# Altium schematic sheet Signal_TX.SchDoc: Signal_TX
size A4; DocumentNumber: 3; SheetNumber: 3; SheetTotal: 8
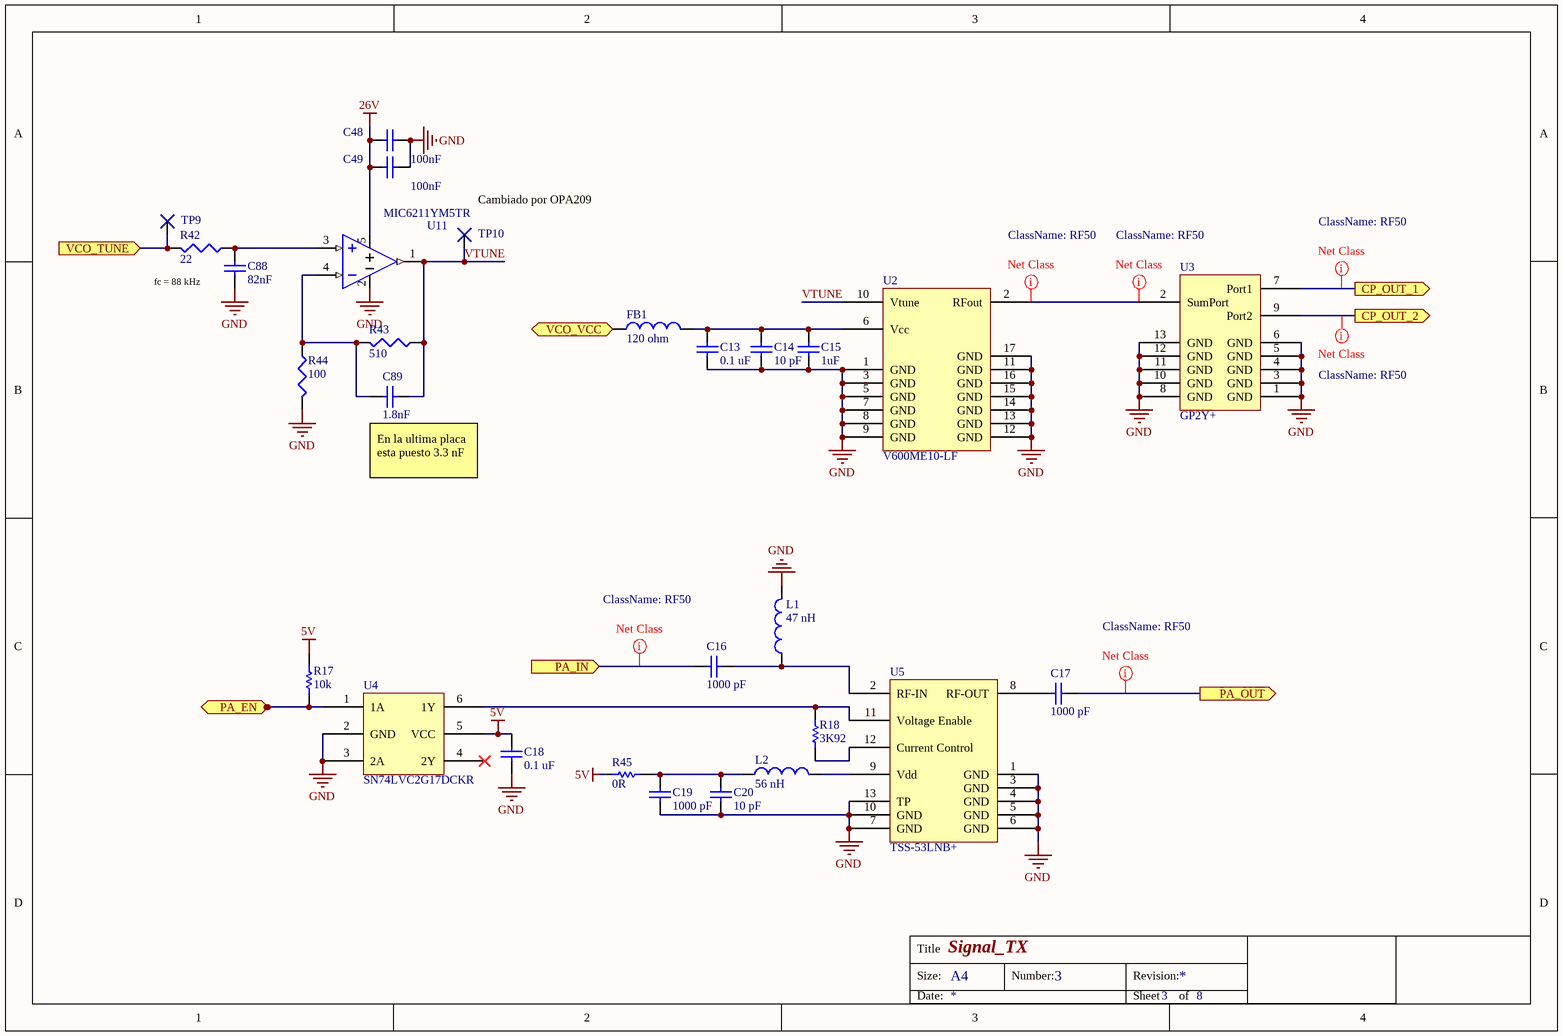
[diagram p0: Signal_TX.SchDoc]

## Parts
C13  0.1 uF  [0603 Cap]
C14  10 pF  [CAPC1005X05L]
C15  1uF  [0603 Cap]
C16  1000 pF  [CAPC1005X05L]
C17  1000 pF  [CAPC1005X05L]
C18  0.1 uF  [0603 Cap]
C19  1000 pF  [CAPC1005X05L]
C20  10 pF  [CAPC1005X05L]
C48  100nF  [0603 Cap]
C49  100nF  [0603 Cap]
C88  82nF  [0603 Cap]
C89  1.8nF  [0603 Cap]
FB1  120 ohm  [INDC1608X08L]
L1  47 nH  [INDC1005X07L]
L2  56 nH  [INDC1005X07L]
R17  10k  [0603 Res]
R18  3K92  [0603 Res]
R42  22  [J1-0603]
R43  510  [J1-0603]
R44  100  [J1-0603]
R45  0R  [0603 Res]
TP9  TEST_POINT_PIN  [TESTPOINT]  (value not drawn)  (no BOM)
TP10  TEST_POINT_PIN  [TESTPOINT]  (value not drawn)  (no BOM)
U2  V600ME10-LF  [CK605]
U3  GP2Y+  [DQ1225]
U4  SN74LVC2G17DCKR  [DCK (R-PDSO-G6)]
U5  TSS-53LNB+  [DQ1225]
U11  MIC6211YM5TR  [SOT95P280X90-5N2]

## Ports
CP_OUT_1 (out), CP_OUT_2 (out), PA_EN (in), PA_IN (in), PA_OUT (out), VCO_TUNE (in), VCO_VCC (in)

## Nets
5V: C18.2 R17.2 R45.2 U4.5(VCC)
26V: C48.2 C49.2 U11.5(V+)
GND: C13.1 C14.1 C15.1 C18.1 C19.1 C20.1 C48.1 C49.1 C88.1 L1.2 R44.2 U2.1(GND) U2.3(GND) U2.5(GND) U2.7(GND) U2.8(GND) U2.9(GND) U2.11(GND) U2.12(GND) U2.13(GND) U2.14(GND) U2.15(GND) U2.16(GND) U2.17(GND) U3.1(GND) U3.3(GND) U3.4(GND) U3.5(GND) U3.6(GND) U3.8(GND) U3.10(GND) U3.11(GND) U3.12(GND) U3.13(GND) U4.2(GND) U4.3(2A) U5.1(GND) U5.3(GND) U5.4(GND) U5.5(GND) U5.6(GND) U5.7(GND) U5.10(GND) U5.13(TP) U11.2(V-)
CP_OUT_1: U3.7(Port1) ; port CP_OUT_1
CP_OUT_2: U3.9(Port2) ; port CP_OUT_2
PA_EN: R17.1 U4.1(1A) ; port PA_EN
PA_IN: C16.1 ; port PA_IN
PA_OUT: C17.1 ; port PA_OUT
VCO_TUNE: R42.2 TP9.1 ; port VCO_TUNE
VCO_VCC: FB1.2 ; port VCO_VCC
VTUNE: C89.1 R43.1 TP10.1 U2.10(Vtune) U11.1(OUTA)
NetC13_2: C13.2 C14.2 C15.2 FB1.1 U2.6(Vcc)
NetC16_2: C16.2 L1.1 U5.2(RF-IN)
NetC17_2: C17.2 U5.8(RF-OUT)
NetC19_2: C19.2 C20.2 L2.1 R45.1
NetC88_2: C88.2 R42.1 U11.3(IN+)
NetC89_2: C89.2 R43.2 R44.1 U11.4(IN-)
NetL2_2: L2.2 U5.9(Vdd)
NetR18_1: R18.1 U5.12(Current_Control)
NetR18_2: R18.2 U4.6(1Y) U5.11(Voltage_Enable)
NetU2_2: U2.2(RFout) U3.2(SumPort)

Not connected (* = marked no-connect by the designer): U4 4(2Y)*

## Layout directives
net class RF50: CP_OUT_1, CP_OUT_2, NetU2_2, PA_IN, PA_OUT

## Notes on the sheet
- (near TP10) Cambiado por OPA209
- fc = 88 kHz
- (near C89) En la ultima placa esta puesto 3.3 nF
- Title
- Size:
- A4
- Number:
- Revision:
- Date:
- Sheet
- of

## Library data of the parts
C13 C18 = CC0603KRX7R7BB104: CAP CER 0.1UF 16V X7R 0603; Manufacturer: Yageo; Tolerance: 10; Capacitance: 100; Voltage Rating: 16; Min Temperature: -55; Material: Ceramic; Supplier 1: Digikey; Manufacturer Part Number: CC0603KRX7R7BB104; Stock 1: 2351469; Pricing 1: 1=0.1, 10=0.019, 25=0.014, 50=0.0104, 100=0.0085, 250=0.0071, 500=0.0061, 1000=0.0048 (USD); Mount: Surface Mount; Case/Package: 0603; Pins: 2; Case Code (Metric): 1608; Case Code (Imperial): 0603; Min Operating Temperature: -55; Max Operating Temperature: 125; Dielectric: X7R; Voltage Rating (DC): 16; Package Quantity: 4000; Packaging: Tape and Reel; Termination: SMD; Composition: Ceramic; Voltage: 16; Length: 1.6; Height: 0.8; Width: 0.8; Thickness: 0.035; Depth: 0.8; Radiation Hardening: No; REACH SVHC: No SVHC; ComponentLink1URL: https://datasheet.ciiva.com/11786/0900766b80d84f1d-11786077.pdf; ComponentLink1Description: https://datasheet.ciiva.com/11786/0900766b80d84f1d-11786077.pdf; ComponentLink2URL: https://datasheet.ciiva.com/15165/getdatasheetpartid-63554-15165387.pdf; ComponentLink2Description: https://datasheet.ciiva.com/15165/getdatasheetpartid-63554-15165387.pdf; ComponentLink3URL: https://datasheet.ciiva.com/13395/upy-gphc-x7r-6-3v-to-50v-8-13395674.pdf; ComponentLink3Description: https://datasheet.ciiva.com/13395/upy-gphc-x7r-6-3v-to-50v-8-13395674.pdf; ComponentLink4URL: https://datasheet.ciiva.com/46430/1734573-46430156.pdf; ComponentLink4Description: https://datasheet.ciiva.com/46430/1734573-46430156.pdf; ComponentLink5URL: https://datasheet.ciiva.com/11464/upy-gphc-x7r-6-3v-to-50v-8-11464735.pdf; ComponentLink5Description: https://datasheet.ciiva.com/11464/upy-gphc-x7r-6-3v-to-50v-8-11464735.pdf; ComponentLink6URL: https://datasheet.ciiva.com/7978/1489800-7978141.pdf; ComponentLink6Description: https://datasheet.ciiva.com/7978/1489800-7978141.pdf; ComponentLink7URL: https://datasheet.ciiva.com/28450/1489800-28450552.pdf; ComponentLink7Description: https://datasheet.ciiva.com/28450/1489800-28450552.pdf; ComponentLink8URL: https://datasheet.ciiva.com/16625/upy-gphc-x7r-6-3v-to-50v-8-16625526.pdf; ComponentLink8Description: https://datasheet.ciiva.com/16625/upy-gphc-x7r-6-3v-to-50v-8-16625526.pdf; ComponentLink9URL: https://datasheet.ciiva.com/144/mlccorderingcode-144182.pdf; ComponentLink9Description: https://datasheet.ciiva.com/144/mlccorderingcode-144182.pdf; ComponentLink10URL: https://datasheet.ciiva.com/8033/1734573-8033797.pdf; ComponentLink10Description: https://datasheet.ciiva.com/8033/1734573-8033797.pdf; ComponentLink11URL: https://datasheet.ciiva.com/144/mlccorderingcode-144184.pdf; ComponentLink11Description: https://datasheet.ciiva.com/144/mlccorderingcode-144184.pdf; ComponentLink12URL: https://datasheet.ciiva.com/8033/70765-8033799.pdf; ComponentLink12Description: https://datasheet.ciiva.com/8033/70765-8033799.pdf; ComponentLink13URL: https://datasheet.ciiva.com/144/mlccorderingcode-144183.pdf; ComponentLink13Description: https://datasheet.ciiva.com/144/mlccorderingcode-144183.pdf; Supplier Part Number 1: 311-1088-1-ND
C14 C20 = CL05C100JB5NNNC: CAP CER 10PF 50V 5% NP0 0402; Manufacturer: Samsung Electro-Mechanics America, Inc; Temperature Coefficient: C0G, NP0; Supplier 1: Digi-Key; Supplier Part Number 1: 1276-1139-1-ND; Manufacturer Part Number: CL05C100JB5NNNC; RoHS: RoHS Compliant; Category: Capacitors; Stock 1: 376482; Pricing 1: 1=0.09, 10=0.011, 25=0.008, 100=0.0052, 500=0.00366, 1000=0.00285, 2500=0.00256, 5000=0.00238 (EUR); Packaging: Cut Tape (CT); Capacitance: 10pF; Tolerance: ±5%; Voltage - Rated: 50V; Mounting Type: Surface Mount, MLCC; Operating Temperature: -55°C ~ 125°C; Applications: General Purpose; Ratings: -; Package / Case: 0402 (1005 Metric); Size / Dimension: 0.039" L x 0.020" W (1.00mm x 0.50mm); Height - Seated (Max): -; Thickness (Max): 0.022" (0.55mm); Lead Spacing: -; Features: -; Lead Style: -; ComponentLink1URL: http://www.samsungsem.com/servlet/FileDownload?type=spec&file=CL05C100JB5NNNC.pdf; ComponentLink1Description: http://www.samsungsem.com/servlet/FileDownload?type=spec&file=CL05C100JB5NNNC.pdf
C15 = CL10B105MO8NNWC: CAP CER 1UF 16V X7R 0603; Manufacturer: Samsung Electro-Mechanics America, Inc.; Capacitance: 1µF; Tolerance: ±20%; Supplier 1: Digi-Key; Manufacturer Part Number: CL10B105MO8NNWC; RoHS: RoHS Compliant; Category: Capacitors; Stock 1: 77746; Pricing 1: 1=0.09, 10=0.02, 25=0.0144, 50=0.0108, 100=0.0089, 250=0.00744, 500=0.00636, 1000=0.00499 (EUR); Packaging: Digi-Reel®; Part Status: Active; Voltage - Rated: 16V; Temperature Coefficient: X7R; Operating Temperature: -55°C ~ 125°C; Features: -; Ratings: -; Applications: General Purpose; Mounting Type: Surface Mount, MLCC; Package / Case: 0603 (1608 Metric); Size / Dimension: 0.063" L x 0.031" W (1.60mm x 0.80mm); Height - Seated (Max): -; Thickness (Max): 0.035" (0.90mm); Lead Spacing: -; Lead Style: -; ComponentLink1URL: http://www.samsungsem.com/kr/support/library/product-catalog/__icsFiles/afieldfile/2016/09/27/MLCC.pdf; ComponentLink1Description: http://www.samsungsem.com/kr/support/library/product-catalog/__icsFiles/afieldfile/2016/09/27/MLCC.pdf; Supplier Part Number 1: 1276-6524-6-ND
C16 C17 C19 = CL05C102JA5NNNC: CAP CER 1000PF 25V 5% NP0 0402; Manufacturer: Samsung Electro-Mechanics America, Inc; Manufacturer Part Number: CL05C102JB5NNNC; Voltage - Rated: 50V; Temperature Coefficient: C0G, NP0; Supplier 1: Digi-Key; Supplier Part Number 1: 1276-1635-1-ND; RoHS: RoHS Compliant; Category: Capacitors; Stock 1: 50559; Pricing 1: 1=0.09, 10=0.053, 25=0.0372, 100=0.0242, 500=0.01694, 1000=0.0132, 2500=0.01188, 5000=0.011 (EUR); Packaging: Cut Tape (CT); Capacitance: 1000pF; Tolerance: ±5%; Mounting Type: Surface Mount, MLCC; Operating Temperature: -55°C ~ 125°C; Applications: General Purpose; Ratings: -; Package / Case: 0402 (1005 Metric); Size / Dimension: 0.039" L x 0.020" W (1.00mm x 0.50mm); Height - Seated (Max): -; Thickness (Max): 0.022" (0.55mm); Lead Spacing: -; Features: -; Lead Style: -; ComponentLink1URL: http://www.samsungsem.com/servlet/FileDownload?type=spec&file=CL05C102JB5NNNC.pdf; ComponentLink1Description: http://www.samsungsem.com/servlet/FileDownload?type=spec&file=CL05C102JB5NNNC.pdf
C48 C49 C88 C89 = C0603C104K4RACTU: CAP CER 0.1UF 16V X7R 0603; Manufacturer: KEMET; Capacitance: 0.1µF; Tolerance: ±10%; Supplier 1: Digi-Key; Manufacturer Part Number: C0603C104K4RACTU; RoHS: RoHS Compliant; Category: Capacitors; Stock 1: 4491346; Pricing 1: 1=0.09, 10=0.022, 25=0.016, 50=0.0122, 100=0.01, 250=0.00836, 500=0.0071, 1000=0.00559 (EUR); Packaging: Digi-Reel®; Part Status: Active; Voltage - Rated: 16V; Temperature Coefficient: X7R; Operating Temperature: -55°C ~ 125°C; Features: -; Ratings: -; Applications: General Purpose; Failure Rate: -; Mounting Type: Surface Mount, MLCC; Package / Case: 0603 (1608 Metric); Size / Dimension: 0.063" L x 0.031" W (1.60mm x 0.80mm); Height - Seated (Max): -; Thickness (Max): 0.034" (0.87mm); Lead Spacing: -; Lead Style: -; ComponentLink1URL: http://www.kemet.com/docfinder?Partnumber=C0603C104K4RACTU; ComponentLink1Description: http://www.kemet.com/docfinder?Partnumber=C0603C104K4RACTU; Supplier Part Number 1: 399-1096-6-ND
FB1 = BLM18PG121SN1D: FERRITE BEAD 120 OHM 0603 1LN; Manufacturer: Murata Electronics North America; Filter Type: Power Line; Number of Lines: 1; Impedance @ Frequency: 120 Ohm @ 100MHz; Current Rating (Max): 2A; DC Resistance (DCR) (Max): 50 mOhm; Supplier 1: Digi-Key; Manufacturer Part Number: BLM18PG121SN1D; RoHS: RoHS Compliant; Category: Filters; Stock 1: 1305577; Pricing 1: 1=0.09, 10=0.067, 25=0.06, 50=0.0438, 100=0.038, 250=0.02996, 500=0.0253, 1000=0.02132 (EUR); Packaging: Cut Tape (CT); Part Status: Active; Ratings: -; Operating Temperature: -55°C ~ 125°C; Package / Case: 0603 (1608 Metric); Mounting Type: Surface Mount; Height (Max): 0.037" (0.95mm); Size / Dimension: 0.063" L x 0.031" W (1.60mm x 0.80mm); ComponentLink1URL: http://www.murata.com/en-us/products/productdata/8796738650142/ENFA0003.pdf; ComponentLink1Description: http://www.murata.com/en-us/products/productdata/8796738650142/ENFA0003.pdf; Supplier Part Number 1: 490-1037-1-ND
L1 = 0402CS-47NXGLU: COILCRAFT - 0402CS-47NXGLU - INDUCTOR, RF, 47NH, 2%, 2.1GHZ, SMD; Supplier 1: Farnell; Manufacturer: COILCRAFT; Manufacturer Part Number: 0402CS-47NXGLU; RoHS: Y-EX; Stock 1: 477; Pricing 1: 1=1,18, 10=1,06, 50=0,89, 100=0,829, 200=0,79, 500=0,529, 1000=0,418 (EUR); ComponentLink1URL: http://www.farnell.com/datasheets/1681871.pdf; ComponentLink1Description: http://www.farnell.com/datasheets/1681871.pdf; Supplier Part Number 1: 2285690
L2 = 0402CS-56NXJLU: Fixed Inductors 0402CS HiFreq Chip 56 nH 5 % 0.1 A; Manufacturer: Coilcraft; Core Material: Ceramic; Maximum DC Current: 100 mA; Maximum DC Resistance: 970 mOhms; Q Minimum: 42; Self Resonant Frequency: 1.76 GHz; Tolerance: 5 %; Test Frequency: 250 MHz; Supplier 1: Mouser; Manufacturer Part Number: 0402CS-56NXJLU; RoHS: RoHS Compliant; Category: Fixed Inductors; Stock 1: 2095; Pricing 1: 1=1.29, 10=1.12, 50=0.914, 100=0.839, 200=0.793, 500=0.500, 1000=0.367, 2000=0.340 (EUR); Height: 0.66 mm; Inductance: 56 nH; Length: 1.19 mm; Operating Temperature Range: - 40 C to + 125 C; Package/Case: 0402 (1005 metric); Packaging: Reel; Product: RF Inductors; Series: 0402CS; Termination Style: SMD/SMT; Width: 0.64 mm; Brand: Coilcraft; Mounting Style: SMD/SMT; Standard Pack Qty: 200; RoHS - Mouser: Y; Minimum Order Quantity: 1; Reeling: True; ComponentLink1URL: http://www.mouser.com/ds/2/597/0402cs-253326.pdf; ComponentLink1Description: http://www.mouser.com/ds/2/597/0402cs-253326.pdf; Supplier Part Number 1: 994-0402CS-56NXJLU
R17 R18 R45 = R_0603: SMD Resistor, 1%, 0.1W, 0603; Tolerance: 1; Power Rating: 100; Mount: Surface Mount; Case/Package: 0603; Pins: 2; Case Code (Imperial): 0603; Case Code (Metric): 1608; Termination: SMD; Length: 1.6; Height: 0.45; Width: 0.8; Depth: 0.8
R42-R44 = Res3: Resistor; Published: 8-Jun-2000; LatestRevisionDate: 29-May-2009; LatestRevisionNote: IPC-7351 Footprint Added.; PackageReference: J1-0603; Publisher: Altium Limited; PackageDescription: Chip Resistor
TP9 TP10 = TEST_POINT_PIN: Test point for single pin
U2 = V600ME10-LF: Voltage-Controlled Oscillator SMD; Manufacturer: ZCOMM; Manufacturer Part Number: V600ME10-LF; Supplier: Monolitic
U3 = GP2Y+: Power Splitter/Combiner; Manufacturer: Minicircuits; Manufacturer Part Number: GP2Y+; Supplier: Aicox
U4 = SN74LVC2G17DCKR: IC BUF NON-INVERT 5.5V SC70-6; Manufacturer: Texas Instruments; Logic Type: Buffer, Non-Inverting; Number of Bits per Element: 1; Input Type: Schmitt Trigger; Output Type: Push-Pull; Current - Output High, Low: 32mA, 32mA; Voltage - Supply: 1.65 V ~ 5.5 V; Supplier 1: Digi-Key; Manufacturer Part Number: SN74LVC2G17DCKR; RoHS: RoHS Compliant; Category: Integrated Circuits (ICs); Stock 1: 76967; Pricing 1: 1=0.47, 10=0.399, 100=0.298, 500=0.2341, 1000=0.18089 (EUR); Packaging: Cut Tape (CT); Part Status: Active; Operating Temperature: -40°C ~ 125°C (TA); Mounting Type: Surface Mount; Package / Case: 6-TSSOP, SC-88, SOT-363; Supplier Device Package: SC-70-6; Base Part Number: 74LVC2G17; ComponentLink1URL: http://www.ti.com/lit/ds/symlink/sn74lvc2g17.pdf; ComponentLink1Description: http://www.ti.com/lit/ds/symlink/sn74lvc2g17.pdf; Supplier Part Number 1: 296-13013-1-ND
U5 = TSS-53LNB+: Low Noise Bypass Amplier; Manufacturer: Minicircuits; Manufacturer Part Number: TSS-53LNB+; Supplier: Aicox
U11 = MIC6211YM5TR: IC OPAMP GP 2.5MHZ SOT23-5; Manufacturer: Microchip Micrel; Input Offset Voltage-Max: 7 mV; No of Channels: 1; Slew Rate-Nom: 6 V/µs; Supply Voltage-Max: 32 V; Supplier 1: Digi-Key; Manufacturer Part Number: MIC6211YM5TR; Stock 1: 6526; Pricing 1: 1=0.32, 25=0.268, 100=0.2472 (USD); Gain Bandwidth-Nom: 2.5 MHz; ComponentLink1URL: https://datasheet.ciiva.com/1796/mic6211-1796048.pdf; ComponentLink1Description: https://datasheet.ciiva.com/1796/mic6211-1796048.pdf; ComponentLink2URL: https://datasheet.ciiva.com/5825/94475-5825392.pdf; ComponentLink2Description: https://datasheet.ciiva.com/5825/94475-5825392.pdf; ComponentLink3URL: https://datasheet.ciiva.com/1796/mic6211-1796049.pdf; ComponentLink3Description: https://datasheet.ciiva.com/1796/mic6211-1796049.pdf; ComponentLink4URL: https://datasheet.ciiva.com/1796/mic6211-1796050.pdf; ComponentLink4Description: https://datasheet.ciiva.com/1796/mic6211-1796050.pdf; ComponentLink5URL: https://datasheet.ciiva.com/13061/mic6211-13061502.pdf; ComponentLink5Description: https://datasheet.ciiva.com/13061/mic6211-13061502.pdf; Supplier Part Number 1: 576-1314-1-ND